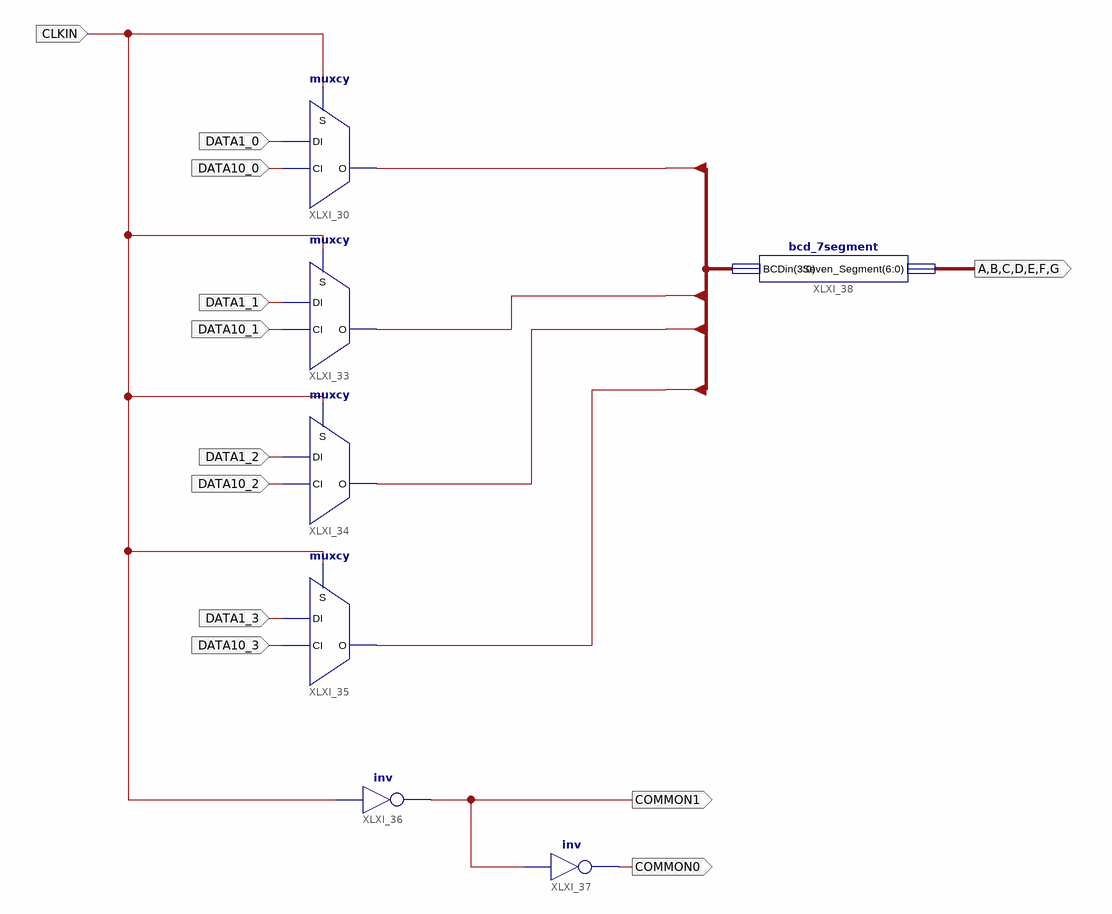
[diagram p0: schematic sheet 1]
// Xilinx ISE schematic Display.sch (spartan6) as structural Verilog: 7 symbols, 12 ports
module Display (
  input  CLKIN,
  input  DATA1_0,
  input  DATA10_0,
  input  DATA1_1,
  input  DATA10_1,
  input  DATA1_2,
  input  DATA10_2,
  input  DATA1_3,
  input  DATA10_3,
  output COMMON1,
  output COMMON0,
  output A,
  output B,
  output C,
  output D,
  output E,
  output F,
  output G
);

  wire [3:0] BCD;

  muxcy XLXI_30 (.CI(DATA10_0), .DI(DATA1_0), .S(CLKIN), .O(BCD[0]));
  muxcy XLXI_33 (.CI(DATA10_1), .DI(DATA1_1), .S(CLKIN), .O(BCD[1]));
  muxcy XLXI_34 (.CI(DATA10_2), .DI(DATA1_2), .S(CLKIN), .O(BCD[2]));
  muxcy XLXI_35 (.CI(DATA10_3), .DI(DATA1_3), .S(CLKIN), .O(BCD[3]));
  not XLXI_36 (COMMON1, CLKIN);
  not XLXI_37 (COMMON0, COMMON1);
  bcd_7segment XLXI_38 (.BCDin(BCD), .Seven_Segment({A, B, C, D, E, F, G}));
endmodule
